# Altium schematic sheet top_level.SchDoc
size A4
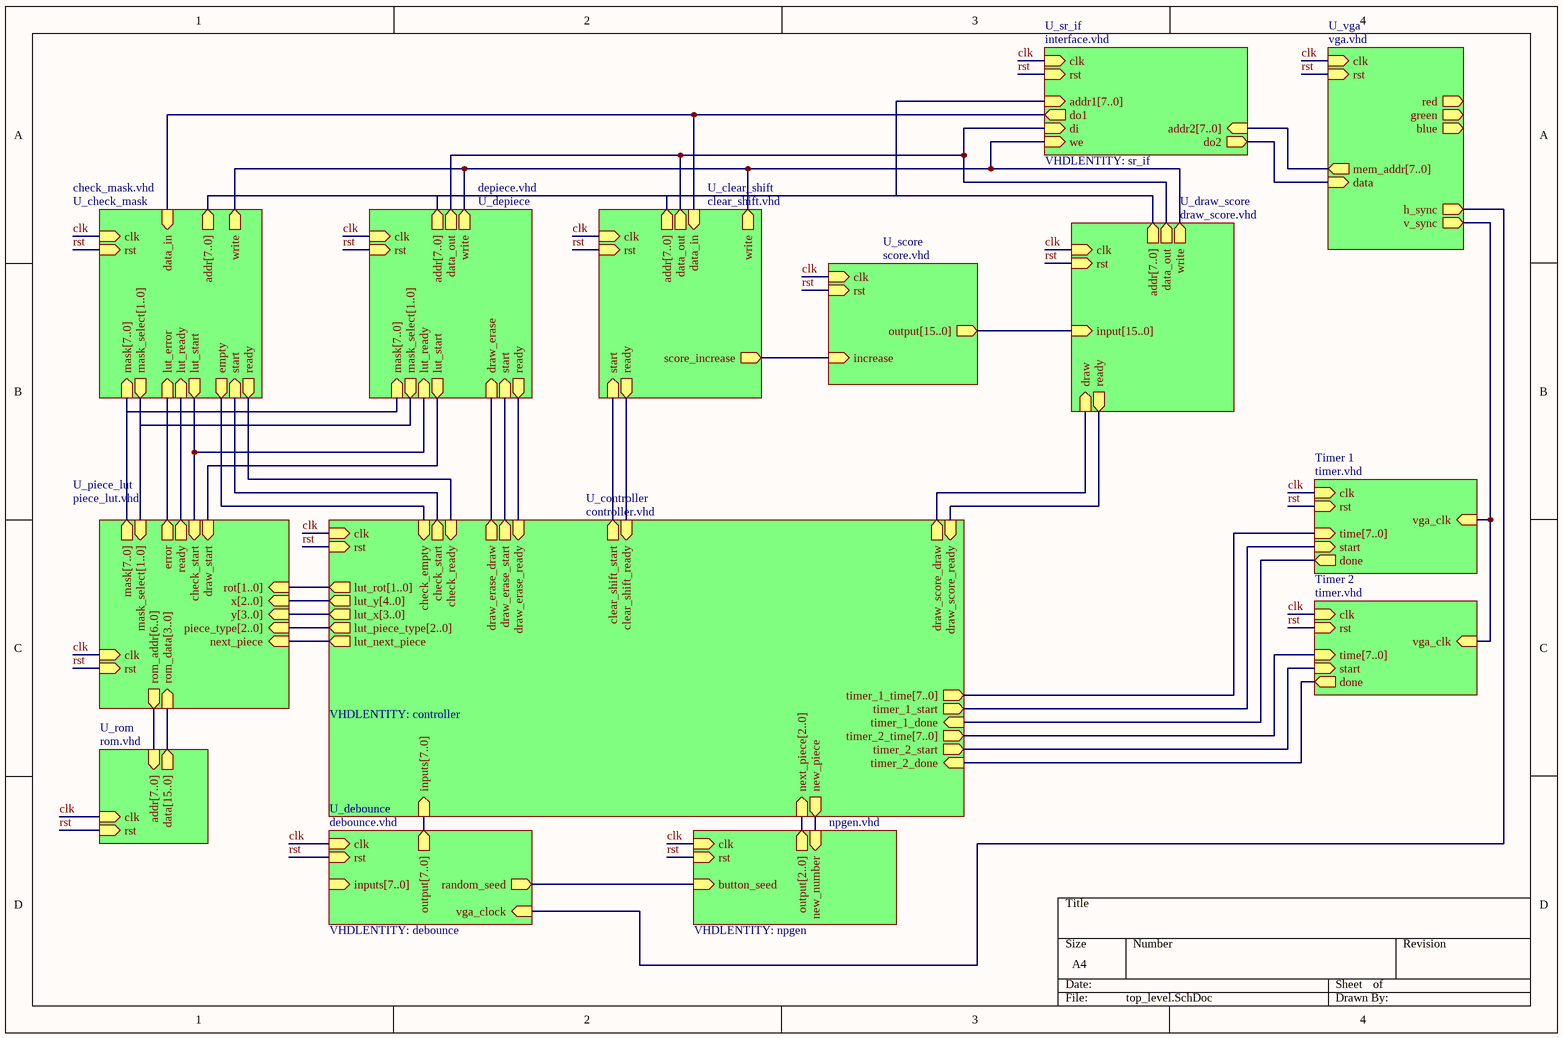
[diagram p0: top_level.SchDoc]

## Sub-sheets
Timer 1 = timer.vhd: clk (in), done (out), rst (in), start (in), time[7..0] (in), vga_clk (in)
Timer 2 = timer.vhd: clk (in), done (out), rst (in), start (in), time[7..0] (in), vga_clk (in)
U_check_mask = check_mask.vhd: clk (in), empty (out), mask[7..0] (in), ready (out), rst (in), start (in), addr[7..0] (out), write (out), mask_select[1..0] (out), data_in (in), lut_start (out), lut_ready (in), lut_error (in)
U_clear_shift = clear_shift.vhd: clk (in), ready (out), rst (in), start (in), addr[7..0] (out), write (out), score_increase (out), data_out (out), data_in (in)
U_controller = controller.vhd: check_empty (in), check_ready (in), check_start (out), clear_shift_ready (in), clear_shift_start (out), clk (in), draw_erase_draw (out), draw_erase_ready (in), draw_erase_start (out), draw_score_draw (out), draw_score_ready (in), new_piece (out), next_piece[2..0] (in), lut_piece_type[2..0] (out), lut_rot[1..0] (out), rst (in), lut_x[3..0] (out), lut_y[4..0] (out), timer_1_time[7..0] (out), timer_1_start (out), timer_1_done (in), timer_2_time[7..0] (out), timer_2_start (out), timer_2_done (in), inputs[7..0] (in), lut_next_piece (out)  | VHDLENTITY: controller
U_debounce = debounce.vhd: clk (in), inputs[7..0] (in), output[7..0] (out), random_seed (out), rst (in), vga_clock (in)  | VHDLENTITY: debounce
U_depiece = depiece.vhd: clk (in), draw_erase (in), mask[7..0] (in), ready (out), rst (in), start (in), addr[7..0] (out), write (out), mask_select[1..0] (out), lut_start (out), lut_ready (in), data_out (out)
U_draw_score = draw_score.vhd: clk (in), draw (in), input[15..0] (in), rst (in), addr[7..0] (out), data_out (out), ready (out), write (out)
U_npgen = npgen.vhd: clk (in), new_number (in), output[2..0] (out), rst (in), button_seed (in)  | VHDLENTITY: npgen
U_piece_lut = piece_lut.vhd: clk (in), mask[7..0] (out), piece_type[2..0] (in), ready (out), rom_addr[6..0] (out), rom_data[3..0] (in), rot[1..0] (in), rst (in), x[2..0] (in), y[3..0] (in), error (out), mask_select[1..0] (in), next_piece (in), check_start (in), draw_start (in)
U_rom = rom.vhd: addr[7..0] (in), clk (in), data[15..0] (out), rst (in)
U_score = score.vhd: clk (in), increase (in), output[15..0] (out), rst (in)
U_sr_if = interface.vhd: addr1[7..0] (in), addr2[7..0] (in), clk (in), di (in), do1 (out), do2 (out), rst (in), we (in)  | VHDLENTITY: sr_if
U_vga = vga.vhd: blue (out), clk (in), green (out), h_sync (out), red (out), rst (in), v_sync (out), mem_addr[7..0] (out), data (in)

## Nets
clk: sheet U_rom/clk, sheet U_piece_lut/clk, sheet U_check_mask/clk, sheet U_depiece/clk, sheet U_clear_shift/clk, sheet U_draw_score/clk, sheet U_score/clk, sheet U_vga/clk, sheet U_npgen/clk, sheet U_controller/clk, sheet U_debounce/clk, sheet Timer 2/clk, sheet Timer 1/clk, sheet U_sr_if/clk
rst: sheet U_rom/rst, sheet U_piece_lut/rst, sheet U_check_mask/rst, sheet U_depiece/rst, sheet U_clear_shift/rst, sheet U_draw_score/rst, sheet U_score/rst, sheet U_vga/rst, sheet U_npgen/rst, sheet U_controller/rst, sheet U_debounce/rst, sheet Timer 2/rst, sheet Timer 1/rst, sheet U_sr_if/rst
(unnamed): sheet U_piece_lut/ready, sheet U_check_mask/lut_ready
(unnamed): sheet U_piece_lut/error, sheet U_check_mask/lut_error
(unnamed): sheet U_piece_lut/next_piece, sheet U_controller/lut_next_piece
(unnamed): sheet U_piece_lut/check_start, sheet U_check_mask/lut_start, sheet U_depiece/lut_ready
(unnamed): sheet U_piece_lut/draw_start, sheet U_depiece/lut_start
(unnamed): sheet U_check_mask/empty, sheet U_controller/check_empty
(unnamed): sheet U_check_mask/ready, sheet U_controller/check_ready
(unnamed): sheet U_check_mask/start, sheet U_controller/check_start
(unnamed): sheet U_check_mask/write, sheet U_depiece/write, sheet U_clear_shift/write, sheet U_draw_score/write, sheet U_sr_if/we
(unnamed): sheet U_check_mask/data_in, sheet U_clear_shift/data_in, sheet U_sr_if/do1
(unnamed): sheet U_depiece/draw_erase, sheet U_controller/draw_erase_draw
(unnamed): sheet U_depiece/ready, sheet U_controller/draw_erase_ready
(unnamed): sheet U_depiece/start, sheet U_controller/draw_erase_start
(unnamed): sheet U_depiece/data_out, sheet U_clear_shift/data_out, sheet U_draw_score/data_out, sheet U_sr_if/di
(unnamed): sheet U_clear_shift/ready, sheet U_controller/clear_shift_ready
(unnamed): sheet U_clear_shift/start, sheet U_controller/clear_shift_start
(unnamed): sheet U_clear_shift/score_increase, sheet U_score/increase
(unnamed): sheet U_draw_score/draw, sheet U_controller/draw_score_draw
(unnamed): sheet U_draw_score/ready, sheet U_controller/draw_score_ready
(unnamed): sheet U_vga/h_sync, sheet U_debounce/vga_clock
(unnamed): sheet U_vga/v_sync, sheet Timer 2/vga_clk, sheet Timer 1/vga_clk
(unnamed): sheet U_vga/data, sheet U_sr_if/do2
(unnamed): sheet U_npgen/new_number, sheet U_controller/new_piece
(unnamed): sheet U_npgen/button_seed, sheet U_debounce/random_seed
(unnamed): sheet U_controller/timer_1_start, sheet Timer 1/start
(unnamed): sheet U_controller/timer_1_done, sheet Timer 1/done
(unnamed): sheet U_controller/timer_2_start, sheet Timer 2/start
(unnamed): sheet U_controller/timer_2_done, sheet Timer 2/done

## Buses and harness runs
bus sheet Timer 1/time[7..0] = sheet U_controller/timer_1_time[7..0]
bus sheet Timer 2/time[7..0] = sheet U_controller/timer_2_time[7..0]
bus sheet U_check_mask/addr[7..0] = sheet U_clear_shift/addr[7..0] = sheet U_depiece/addr[7..0] = sheet U_draw_score/addr[7..0] = sheet U_sr_if/addr1[7..0]
bus sheet U_check_mask/mask[7..0] = sheet U_depiece/mask[7..0] = sheet U_piece_lut/mask[7..0]
bus sheet U_check_mask/mask_select[1..0] = sheet U_depiece/mask_select[1..0] = sheet U_piece_lut/mask_select[1..0]
bus sheet U_controller/inputs[7..0] = sheet U_debounce/output[7..0]
bus sheet U_controller/lut_piece_type[2..0] = sheet U_piece_lut/piece_type[2..0]
bus sheet U_controller/lut_rot[1..0] = sheet U_piece_lut/rot[1..0]
bus sheet U_controller/lut_x[3..0] = sheet U_piece_lut/y[3..0]
bus sheet U_controller/lut_y[4..0] = sheet U_piece_lut/x[2..0]
bus sheet U_controller/next_piece[2..0] = sheet U_npgen/output[2..0]
bus sheet U_draw_score/input[15..0] = sheet U_score/output[15..0]
bus sheet U_piece_lut/rom_addr[6..0] = sheet U_rom/addr[7..0]
bus sheet U_piece_lut/rom_data[3..0] = sheet U_rom/data[15..0]
bus sheet U_sr_if/addr2[7..0] = sheet U_vga/mem_addr[7..0]